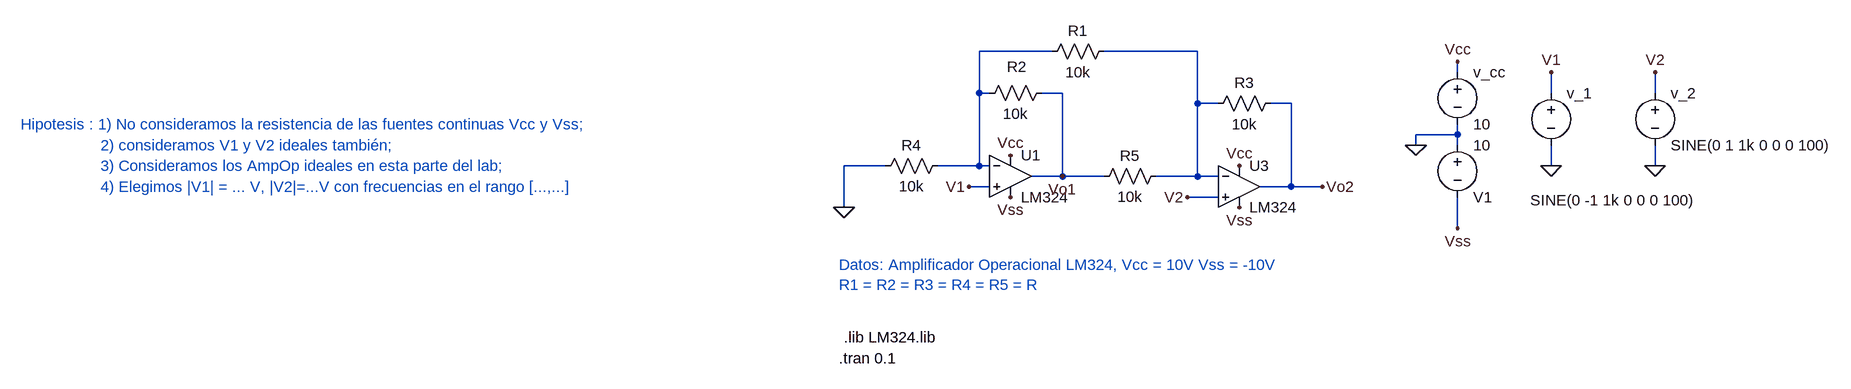
[diagram p0: schematic Lab1_Circuito1.asc]
Lab1_Circuito1.asc, the LTspice schematic file:
Version 4
SHEET 1 2280 1444
WIRE 576 -32 464 -32
WIRE 800 -32 656 -32
WIRE 1200 0 1200 -16
WIRE 464 32 464 -32
WIRE 480 32 464 32
WIRE 592 32 560 32
WIRE 1344 32 1344 0
WIRE 1504 32 1504 0
WIRE 800 48 800 -32
WIRE 832 48 800 48
WIRE 944 48 912 48
WIRE 1200 96 1200 80
WIRE 1200 96 1136 96
WIRE 1136 112 1136 96
WIRE 1200 112 1200 96
WIRE 320 144 256 144
WIRE 464 144 464 32
WIRE 464 144 400 144
WIRE 480 144 464 144
WIRE 1344 144 1344 112
WIRE 1504 144 1504 112
WIRE 592 160 592 32
WIRE 592 160 544 160
WIRE 656 160 592 160
WIRE 800 160 800 48
WIRE 800 160 736 160
WIRE 832 160 800 160
WIRE 480 176 448 176
WIRE 944 176 944 48
WIRE 944 176 896 176
WIRE 992 176 944 176
WIRE 832 192 784 192
WIRE 256 208 256 144
WIRE 1200 240 1200 192
FLAG 256 208 0
FLAG 992 176 Vo2
FLAG 1136 112 0
FLAG 1344 144 0
FLAG 1504 144 0
FLAG 1200 -16 Vcc
FLAG 1344 0 V1
FLAG 1504 0 V2
FLAG 512 128 Vcc
FLAG 864 144 Vcc
FLAG 512 192 Vss
FLAG 864 208 Vss
FLAG 1200 240 Vss
FLAG 592 160 Vo1
FLAG 784 192 V2
FLAG 448 176 V1
SYMBOL res 672 -48 R90
WINDOW 0 0 56 VBottom 2
WINDOW 3 32 56 VTop 2
SYMATTR InstName R1
SYMATTR Value 10k
SYMBOL res 576 16 R90
WINDOW 0 -9 54 VBottom 2
WINDOW 3 32 56 VTop 2
SYMATTR InstName R2
SYMATTR Value 10k
SYMBOL res 928 32 R90
WINDOW 0 0 56 VBottom 2
WINDOW 3 32 56 VTop 2
SYMATTR InstName R3
SYMATTR Value 10k
SYMBOL res 416 128 R90
WINDOW 0 0 56 VBottom 2
WINDOW 3 32 56 VTop 2
SYMATTR InstName R4
SYMATTR Value 10k
SYMBOL res 752 144 R90
WINDOW 0 0 56 VBottom 2
WINDOW 3 32 56 VTop 2
SYMATTR InstName R5
SYMATTR Value 10k
SYMBOL voltage 1200 -16 R0
WINDOW 123 0 0 Left 0
WINDOW 39 0 0 Left 0
SYMATTR InstName v_cc
SYMATTR Value 10
SYMBOL voltage 1344 16 R0
WINDOW 3 -32 181 Left 2
WINDOW 123 0 0 Left 0
WINDOW 39 0 0 Left 0
SYMATTR Value SINE(0 -1 1k 0 0 0 100)
SYMATTR InstName v_1
SYMBOL voltage 1504 16 R0
WINDOW 123 0 0 Left 0
WINDOW 39 0 0 Left 0
SYMATTR InstName v_2
SYMATTR Value SINE(0 1 1k 0 0 0 100)
SYMBOL OpAmps\\opamp2 864 112 R0
SYMATTR InstName U3
SYMATTR Value LM324
SYMBOL OpAmps\\opamp2 512 96 R0
SYMATTR InstName U1
SYMATTR Value LM324
SYMBOL voltage 1200 96 R0
WINDOW 0 24 96 Left 2
WINDOW 3 24 16 Left 2
WINDOW 123 0 0 Left 0
WINDOW 39 0 0 Left 0
SYMATTR InstName V1
SYMATTR Value 10
TEXT 248 296 Left 2 ;Datos: Amplificador Operacional LM324, Vcc = 10V Vss = -10V\nR1 = R2 = R3 = R4 = R5 = R
TEXT -576 80 Center 2 ;Hipotesis : 1) No consideramos la resistencia de las fuentes continuas Vcc y Vss;
TEXT -888 112 Left 2 ;2) consideramos V1 y V2 ideales también;
TEXT -888 144 Left 2 ;3) Consideramos los AmpOp ideales en esta parte del lab;
TEXT -888 176 Left 2 ;4) Elegimos |V1| = ... V, |V2|=...V con frecuencias en el rango [...,...]
TEXT 248 440 Left 2 !.tran 0.1
TEXT 256 408 Left 2 !.lib LM324.lib

The netlist it stands for:
* Lab1_Circuito1.asc
R1 N002 N001 10k
R2 Vo1 N001 10k
R3 Vo2 N002 10k
R4 N001 0 10k
R5 N002 Vo1 10k
v_cc Vcc 0 10
v_1 V1 0 SINE(0 -1 1k 0 0 0 100)
v_2 V2 0 SINE(0 1 1k 0 0 0 100)
XU3 V2 N002 Vcc Vss Vo2 LM324  ; pins In+ In- V+ V- OUT
XU1 V1 N001 Vcc Vss Vo1 LM324  ; pins In+ In- V+ V- OUT
V1 0 Vss 10
* Datos: Amplificador Operacional LM324, Vcc = 10V Vss = -10V
* R1 = R2 = R3 = R4 = R5 = R
* Hipotesis : 1) No consideramos la resistencia de las fuentes continuas Vcc y Vss;
* 2) consideramos V1 y V2 ideales también;
* 3) Consideramos los AmpOp ideales en esta parte del lab;
* 4) Elegimos |V1| = ... V, |V2|=...V con frecuencias en el rango [...,...]
.tran 0.1
.lib LM324.lib
.backanno
.end